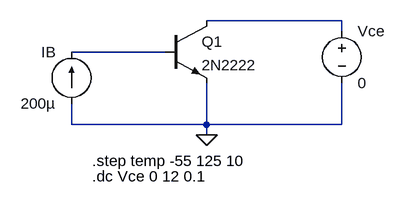
[diagram p0: schematic caratteristiche BJT.asc]
caratteristiche BJT.asc, the LTspice schematic file:
Version 4
SHEET 1 880 680
WIRE 528 160 320 160
WIRE 528 176 528 160
WIRE 256 208 112 208
WIRE 112 320 112 288
WIRE 320 320 320 256
WIRE 320 320 112 320
WIRE 528 320 528 256
WIRE 528 320 320 320
WIRE 320 336 320 320
FLAG 320 336 0
SYMBOL npn2 256 160 R0
SYMATTR InstName Q1
SYMATTR Value 2N2222
SYMBOL voltage 528 160 R0
WINDOW 123 0 0 Left 0
WINDOW 39 0 0 Left 0
SYMATTR InstName Vce
SYMATTR Value 0
SYMBOL current 112 288 R180
WINDOW 0 24 80 Left 2
WINDOW 3 24 0 Left 2
WINDOW 123 0 0 Left 0
WINDOW 39 0 0 Left 0
SYMATTR InstName IB
SYMATTR Value 200µ
TEXT 144 376 Left 2 !.step temp -55 125 10
TEXT 144 400 Left 2 !.dc Vce 0 12 0.1

The netlist it stands for:
* caratteristiche BJT.asc
Q1 N001 N002 0 0 2N2222
Vce N001 0 0
IB 0 N002 200µ
.model NPN NPN
.model PNP PNP
.lib standard.bjt
.step temp -55 125 10
.dc Vce 0 12 0.1
.backanno
.end